# Altium schematic sheet USB.SchDoc
size A4
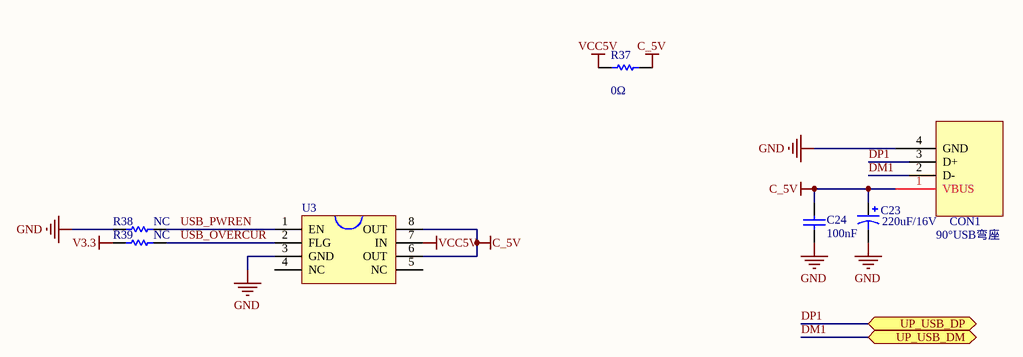
[diagram p0: USB.SchDoc]

## Parts
C23  220uF/16V  [C-6032]
C24  100nF  [0402]
CON1  90°USB弯座  [1364372]
R37  0Ω  [R0805N]
R38  NC  [0402]
R39  NC  [0402]
U3  NC  [SO8_N]  (value not drawn)

## Ports
UP_USB_DM, UP_USB_DP

## Nets
C_5V: C23.1 C24.2 CON1.1(VBUS) R37.2 U3.6(OUT) U3.8(OUT)
GND: C23.2 C24.1 CON1.4(GND) R38.2 U3.3(GND)
V3.3: R39.2
VCC5V: R37.1 U3.7(IN)
DM1: CON1.2(D-) ; port UP_USB_DM
DP1: CON1.3(D+) ; port UP_USB_DP
USB_OVERCUR: R39.1 U3.2(FLG)
USB_PWREN: R38.1 U3.1(EN)

Not connected (* = marked no-connect by the designer): U3 4(NC) 5(NC)

## Library data of the parts
C23 = Cap Pol1: Polarized Capacitor (Radial); Published: 8-Jun-2000; LatestRevisionDate: 17-Jul-2002; LatestRevisionNote: Re-released for DXP Platform.; PackageReference: RB7.6-15; Publisher: Altium Limited; PackageDescription: Polarized Capacitor (Radial); 2 Leads; Value: 220uF/16V
C24 = CAP: Value: 100nF
CON1 = USB-CON: Value: 90°USB弯座
R37 = Res Semi: Semiconductor Resistor; Published: 8-Jun-2000; LatestRevisionDate: 17-Jul-2002; LatestRevisionNote: Re-released for DXP Platform.; PackageReference: AXIAL-0.5; Publisher: Altium Limited; Value: 0Ω
R38 R39 = RES: Value: NC
U3 = MIC2025-1: Value: NC